# Altium schematic sheet BlockDiagram.SchDoc: Block diagram.
size 297 x 209 mm; Author: Dmitry Shpakov; Organization: NoName; Revision: Revision; SheetNumber: 2; SheetTotal: 11; PageSize: A4; ProjectName: Project Name
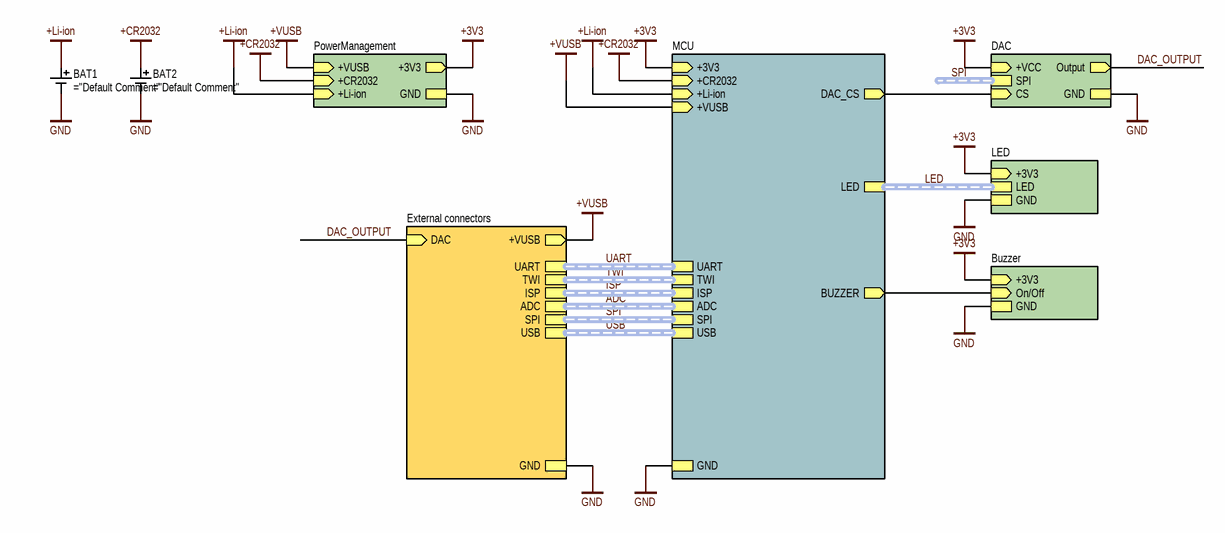
[diagram p0: BlockDiagram.SchDoc]

## Parts
BAT1  (no value)
BAT2  (no value)

## Sub-sheets
Buzzer = Buzzer.SchDoc: +3V3 (in), On/Off (in), GND
DAC = DAC.SchDoc: SPI (harness SPI), GND, CS (in), +VCC (in), Output (out)
External connectors = External_connectors.SchDoc: UART (harness UART), TWI (harness TWI), ISP (harness ISP), ADC (harness ADC), SPI (harness SPI), DAC (in), GND, USB (harness USB), +VUSB (out)
LED = LED.SchDoc: GND, LED (harness LED), +3V3 (in)
MCU = MCU.SchDoc: USB (harness USB), GND, +3V3 (in), SPI (harness SPI), DAC_CS (out), UART (harness UART), TWI (harness TWI), ISP (harness ISP), ADC (harness ADC), LED (harness LED), +VUSB (in), +Li-ion (in), +CR2032 (in), BUZZER (out)
PowerManagement = PowerManagement.SchDoc: +3V3 (out), GND, +VUSB (in), +CR2032 (in), +Li-ion (in)

## Nets
+3V3: sheet PowerManagement/+3V3, sheet MCU/+3V3, sheet DAC/+VCC, sheet LED/+3V3, sheet Buzzer/+3V3
+CR2032: BAT2.POS ; sheet PowerManagement/+CR2032, sheet MCU/+CR2032
+Li-ion: BAT1.POS ; sheet PowerManagement/+Li-ion, sheet MCU/+Li-ion
+VUSB: sheet PowerManagement/+VUSB, sheet MCU/+VUSB, sheet External connectors/+VUSB
GND: BAT1.NEG BAT2.NEG ; sheet PowerManagement/GND, sheet MCU/GND, sheet DAC/GND, sheet External connectors/GND, sheet LED/GND, sheet Buzzer/GND
DAC_OUTPUT: sheet DAC/Output, sheet External connectors/DAC
(unnamed): sheet MCU/DAC_CS, sheet DAC/CS
(unnamed): sheet MCU/BUZZER, sheet Buzzer/On/Off

## Buses and harness runs
harness ADC = sheet External connectors/ADC = sheet MCU/ADC
harness ISP = sheet External connectors/ISP = sheet MCU/ISP
harness LED = sheet LED/LED = sheet MCU/LED
harness SPI = sheet DAC/SPI
harness SPI = sheet External connectors/SPI = sheet MCU/SPI
harness TWI = sheet External connectors/TWI = sheet MCU/TWI
harness UART = sheet External connectors/UART = sheet MCU/UART
harness USB = sheet External connectors/USB = sheet MCU/USB

## Notes on the sheet
- Author
- Date
- Organization
- Page
- Total pages
- Materials
- Page size

## Library data of the parts
BAT1 = S2B-PH-K-S(LF)(SN): CONN HEADER R/A 2POS 2MM; Manufacturer: JST Sales America Inc.; Default Comment: JST-PH-2; Power Dissipation: * W; Rated Voltage: * V; Rated Current: * A; Tolerance: * %; Other: Connector Header Through Hole, Right Angle 2 position 0.079" (2.00mm); Operating Temperature: -25 °C to +85 °C; Type: connector; HelpURL: https://www.digikey.com/en/products/detail/jst-sales-america-inc/S2B-PH-K-S-LF-SN/926626; Rated Power: * W; Value: *; Summary: ="Type"+" "+"Part Number"+" "+"Manufacturer"+" "+"Value"+" "+"Tolerance"+" "+"Operating Temperature"+" "+"Case"+" "+"Power Dissipation"+" "+"Rated Current"+" "+"Rated Power"+" "+"Rated Voltage"+" "+"Other"; Assembly: *; Case: JST-PH-2; Part Number: S2B-PH-K-S(LF)(SN)
BAT2 = BU2032SM-HD-G: BATT HOLDER COIN 20MM 1 CELL SMD; Manufacturer: MPD (Memory Protection Devices); Default Comment: CR2032; Power Dissipation: * W; Rated Voltage: * V; Rated Current: * A; Tolerance: * %; Other: Battery Holder (Open) Coin, 20.0mm 1 Cell SMD (SMT) Tab; Operating Temperature: -40 °C to +280 °C; Type: connector; HelpURL: https://www.digikey.com/en/products/detail/mpd-memory-protection-devices/BU2032SM-HD-G/755446; Rated Power: * W; Value: *; Summary: ="Type"+" "+"Part Number"+" "+"Manufacturer"+" "+"Value"+" "+"Tolerance"+" "+"Operating Temperature"+" "+"Case"+" "+"Power Dissipation"+" "+"Rated Current"+" "+"Rated Power"+" "+"Rated Voltage"+" "+"Other"; Assembly: *; Case: CR2032; Part Number: BU2032SM-HD-G